# EAGLE design weaver_multisw (EAGLE 7.4.0)
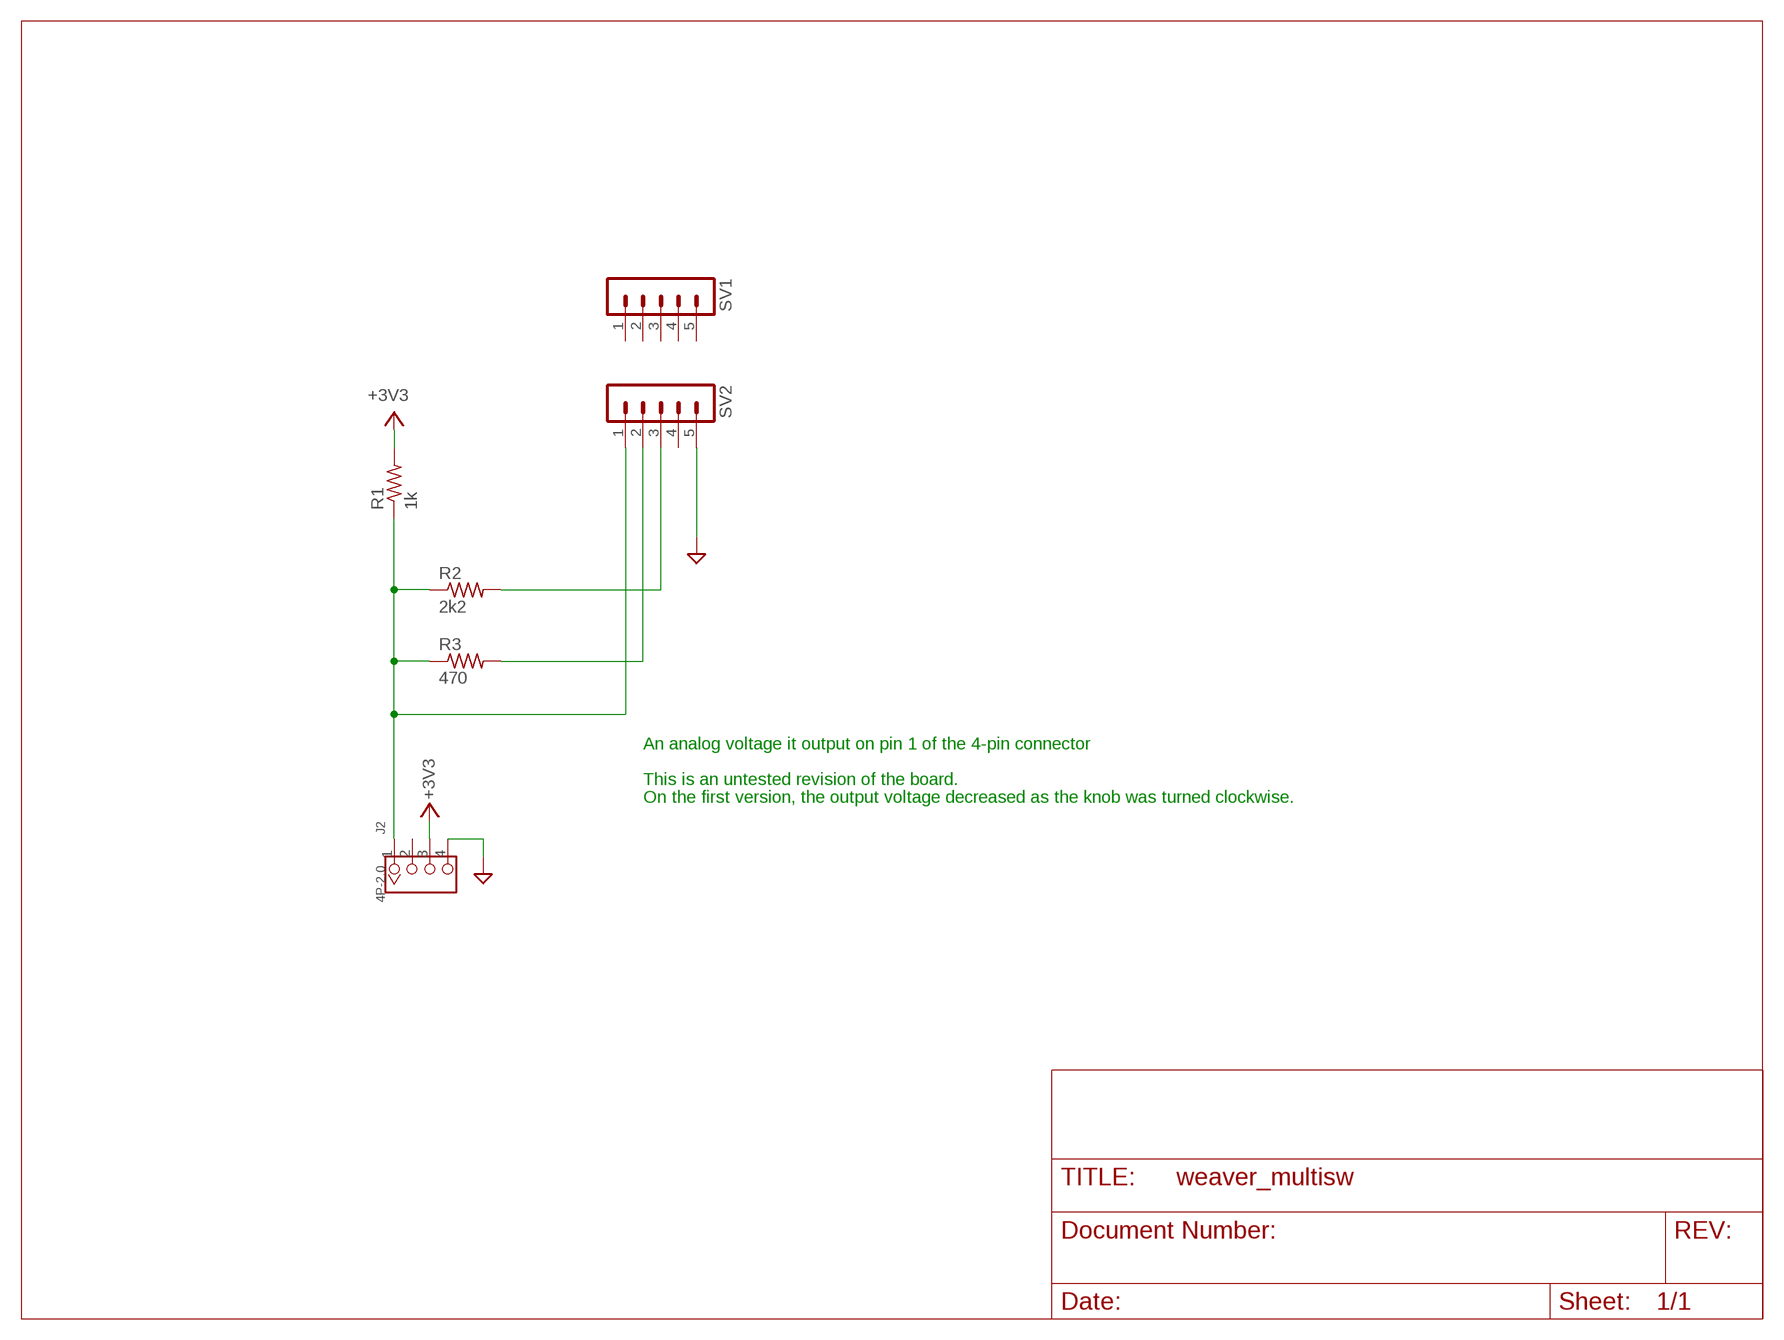
[diagram p0: schematic, sheet 1]

## Parts
J2  4P-2.0  GROVE-CONNECTOR-DIP(4P-2.0)  [HW4-2.0]
R1  1k  R-US_R0805  [R0805]
R2  2k2  R-US_R0805  [R0805]
R3  470  R-US_R0805  [R0805]
SV1  MA05-1  [MA05-1]
SV2  MA05-1  [MA05-1]

## Nets
GND: J2.4 SV2.5
N$1: J2.1 R1.1 R2.1 R3.1 SV2.1
N$2: R2.2 SV2.3
N$3: R3.2 SV2.2
V+: J2.3 R1.2 ; supply symbol labelled +3V3
Unconnected: J2.2 SV1.1 SV1.2 SV1.3 SV1.4 SV1.5 SV2.4

## Notes on the sheet
- An analog voltage it output on pin 1 of the 4-pin connector
- This is an untested revision of the board.
- On the first version, the output voltage decreased as the knob was turned clockwise.

## Library data of the parts
J2 = NanoPlaygroundFace:GROVE-CONNECTOR-DIP(4P-2.0): 320110033
R1-R3 = rcl:R-US_: RESISTOR, American symbol
SV1 SV2 = con-lstb:MA05-1: PIN HEADER; OC_FARNELL: unknown; OC_NEWARK: unknown

## Board
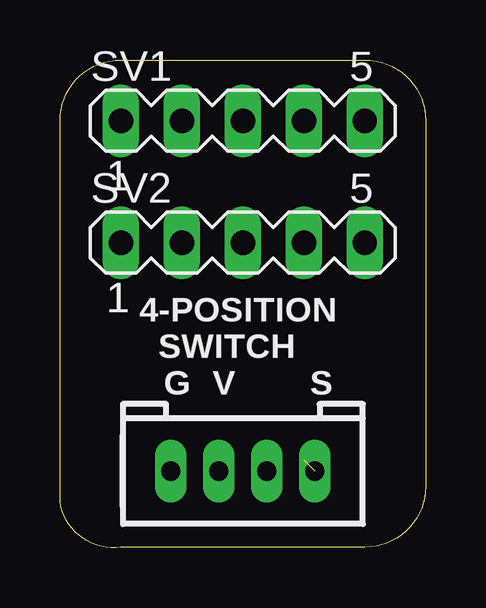
[diagram p1: board, top side]
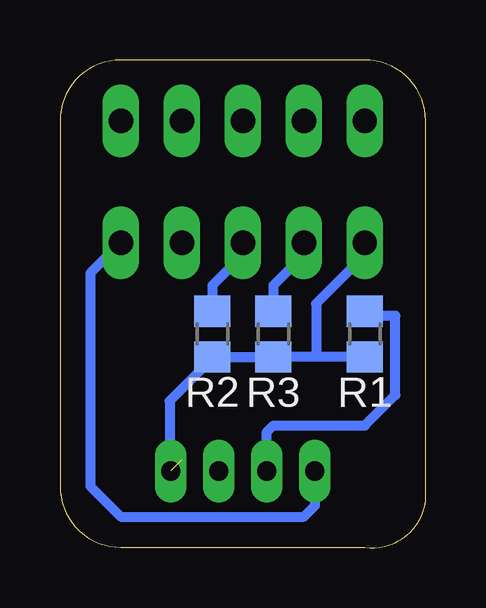
[diagram p2: board, bottom side, seen from below]

Size 15.24 x 20.34 mm. Coordinates in mm from the lower left corner, seen from the top.
Outline: 0,1.93 0,17.8 arc-90 2.54,20.34 12.7,20.34 arc-90 15.24,17.8 15.24,2.56 arc-90 12.7,0.02 2.54,0.02 arc-90 0,1.93
Copper layers (1*16): Top 0.035mm / dielectric 1.5mm / Bottom 0.035mm
Design rules "SeeedStudio_2layer_DRU_no_angle_20140221 *": minimum track width 6mil, minimum drill 12mil, track to track 10mil, track to pad 10mil, pad to pad 10mil, via to via 10mil, smd to smd 0mil, copper to edge 10mil, drill to drill 10mil, minimum pad ring 10mil, minimum via ring 6mil, stop-mask expansion 2mil, vias tented up to drill 100mil, thermal gap 10mil
tRestrict: area 3.6,8 to 5.3,9.8; area 16.9,23.2 to 18.7,25; area 16.9,18.2 to 18.7,20; area 37.2,18.2 to 39,20; area 37.3,23.2 to 39,25; area 57.6,23.2 to 59.4,25; area 57.6,18.2 to 59.4,20
bRestrict: area 16.9,23.2 to 18.7,25; area 3.5,8 to 5.3,9.8; area 16.9,18.2 to 18.7,20; area 37.3,23.2 to 39,25; area 37.3,18.2 to 39,20; area 57.6,23.2 to 59.4,25; area 57.6,18.2 to 59.3,20

### Footprints (pad centres in the part's own frame; a part is rotated, then mirrored left to right if it is on the bottom)
HW4-2.0 = drill 0.8 pad 1.27 long: 1 -3,0; 2 -1,0; 3 1,0; 4 3,0
R0805 = smd 1.3 x 1.5: 1 -0.95,0; 2 0.95,0
MA05-1 = drill 1.016 long: 1 -5.08,0; 2 -2.54,0; 3 0,0; 4 2.54,0; 5 5.08,0

### Placement (x,y rotation side)
J2  7.62,3.2 180 top
R1  2.54,8.91 90 bottom
R2  8.89,8.91 90 bottom
R3  6.35,8.91 90 bottom
SV1  7.62,17.8 0 top
SV2  7.62,12.72 0 top

### Tracks (layer width: path | path; a pad name or v marks a point on that pad's centre or on a via)
GND
  Bottom 0.406: SV2.5 13.97,11.45 13.97,2.56 12.7,1.29 5.08,1.29 4.62,1.75 J2.4
N$1  (1 unrouted)
  Bottom 0.406: SV2.1 2.54,12.21 4.57,10.18 4.57,7.96 | R1.1 4.57,7.96 | 4.57,7.96 R3.1 R2.1 8.89,7.89 10.67,6.12 10.67,3.24 J2.1
N$2
  Bottom 0.406: SV2.3 7.62,12.21 8.89,10.94 R2.2
N$3
  Bottom 0.406: SV2.2 5.08,12.21 6.35,10.94 R3.2
V+
  Bottom 0.406: J2.3 6.62,4.83 6.35,5.1 2.54,5.1 1.27,6.37 1.27,9.67 2.35,9.67 R1.2

### Text on the board
tPlace: 4-POSITION / SWITCH | G | V | S